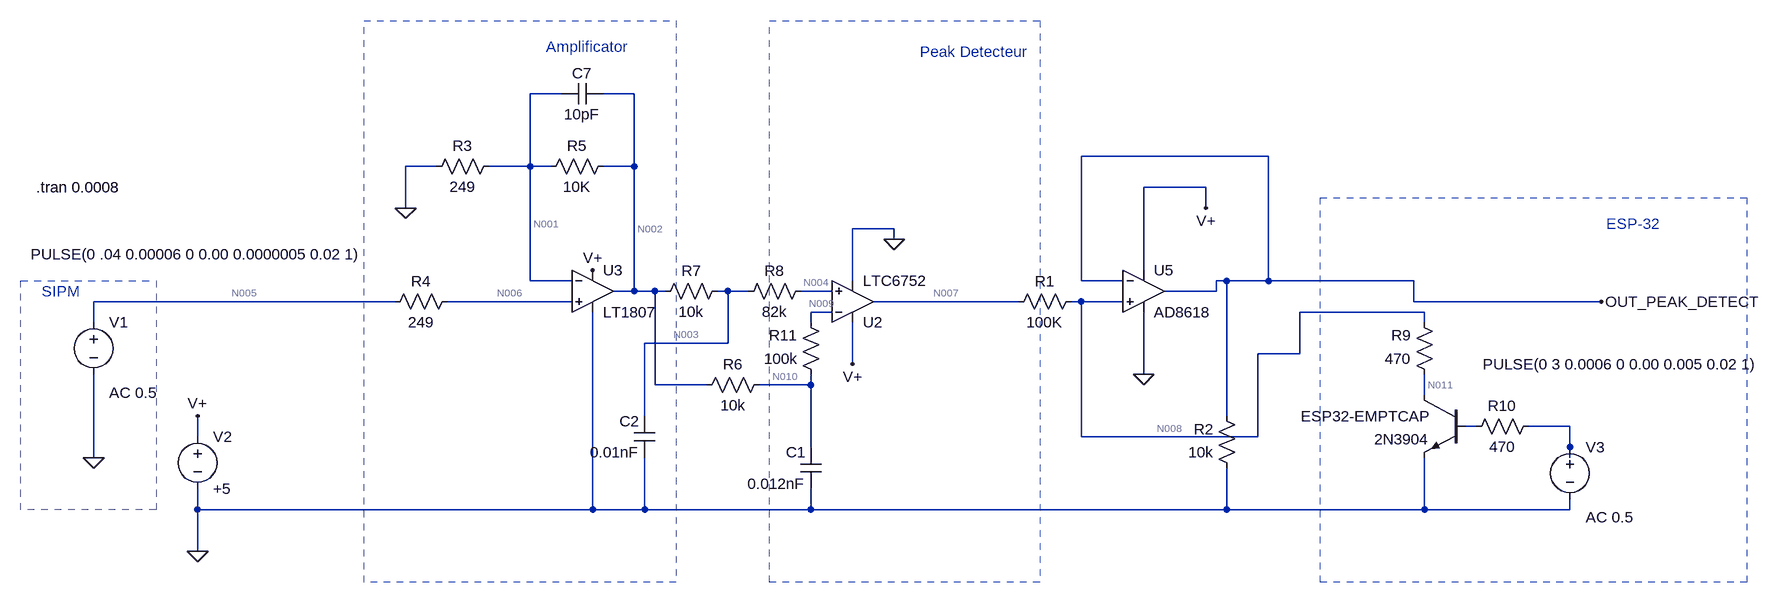
[diagram p0: schematic Muons_V4_c.asc]
Muons_V4_c.asc, the LTspice schematic file:
Version 4
SHEET 1 5945676 13421556
WIRE 624 -368 576 -368
WIRE 736 -368 688 -368
WIRE 1712 -272 1424 -272
WIRE 432 -256 384 -256
WIRE 576 -256 576 -368
WIRE 576 -256 512 -256
WIRE 608 -256 576 -256
WIRE 736 -256 736 -368
WIRE 736 -256 688 -256
WIRE 1616 -224 1520 -224
WIRE 384 -192 384 -256
WIRE 1616 -192 1616 -224
WIRE 1136 -160 1072 -160
WIRE 1136 -144 1136 -160
WIRE 1520 -96 1520 -224
WIRE 576 -80 576 -256
WIRE 640 -80 576 -80
WIRE 1072 -80 1072 -160
WIRE 1424 -80 1424 -272
WIRE 1488 -80 1424 -80
WIRE 1648 -80 1632 -80
WIRE 1712 -80 1712 -272
WIRE 1712 -80 1648 -80
WIRE 1936 -80 1712 -80
WIRE 736 -64 736 -256
WIRE 736 -64 704 -64
WIRE 768 -64 736 -64
WIRE 784 -64 768 -64
WIRE 880 -64 864 -64
WIRE 912 -64 880 -64
WIRE 1040 -64 992 -64
WIRE 1632 -64 1632 -80
WIRE 1632 -64 1552 -64
WIRE 368 -48 -96 -48
WIRE 640 -48 448 -48
WIRE 1328 -48 1104 -48
WIRE 1424 -48 1408 -48
WIRE 1488 -48 1424 -48
WIRE 1936 -48 1936 -80
WIRE 2224 -48 1936 -48
WIRE 1040 -32 1008 -32
WIRE 1952 -32 1760 -32
WIRE -96 -16 -96 -48
WIRE 1008 -16 1008 -32
WIRE 1952 -16 1952 -32
WIRE 880 16 880 -64
WIRE 880 16 752 16
WIRE 1760 32 1760 -32
WIRE 1760 32 1696 32
WIRE 1072 48 1072 -16
WIRE 1520 64 1520 -32
WIRE 768 80 768 -64
WIRE 848 80 768 80
WIRE 1008 80 1008 64
WIRE 1008 80 928 80
WIRE 1952 96 1952 64
WIRE 752 128 752 16
WIRE 1648 128 1648 -80
WIRE 2032 144 2016 144
WIRE 2176 144 2112 144
WIRE 64 160 64 128
WIRE 1424 160 1424 -48
WIRE 1696 160 1696 32
WIRE 1696 160 1424 160
WIRE 1008 176 1008 80
WIRE 2176 176 2176 144
WIRE -96 192 -96 64
WIRE 2176 192 2176 176
WIRE 64 272 64 240
WIRE 672 272 672 -32
WIRE 672 272 64 272
WIRE 752 272 752 192
WIRE 752 272 672 272
WIRE 1008 272 1008 240
WIRE 1008 272 752 272
WIRE 1648 272 1648 208
WIRE 1648 272 1008 272
WIRE 1952 272 1952 192
WIRE 1952 272 1648 272
WIRE 2176 272 2176 256
WIRE 2176 272 1952 272
WIRE 64 336 64 272
FLAG -96 192 0
FLAG 64 336 0
FLAG 672 -96 V+
FLAG 64 128 V+
FLAG 384 -192 0
FLAG 2224 -48 OUT_PEAK_DETECT
FLAG 1520 64 0
FLAG 1616 -192 V+
FLAG 1072 48 V+
FLAG 1136 -144 0
SYMBOL voltage -96 -32 R0
WINDOW 123 24 124 Left 2
WINDOW 39 0 0 Left 0
WINDOW 3 -97 -89 Left 2
SYMATTR Value2 AC 0.5
SYMATTR Value PULSE(0 .04 0.00006 0 0.00 0.0000005 0.02 1)
SYMATTR InstName V1
SYMBOL res 704 -272 R90
WINDOW 0 0 56 VBottom 2
WINDOW 3 32 56 VTop 2
SYMATTR InstName R5
SYMATTR Value 10K
SYMBOL res 464 -64 R90
WINDOW 0 0 56 VBottom 2
WINDOW 3 32 56 VTop 2
SYMATTR InstName R4
SYMATTR Value 249
SYMBOL res 528 -272 R90
WINDOW 0 0 56 VBottom 2
WINDOW 3 32 56 VTop 2
SYMATTR InstName R3
SYMATTR Value 249
SYMBOL cap 688 -384 R90
WINDOW 0 0 32 VBottom 2
WINDOW 3 32 32 VTop 2
SYMATTR InstName C7
SYMATTR Value 10pF
SYMBOL voltage 64 144 R0
WINDOW 123 0 0 Left 0
WINDOW 39 0 0 Left 0
SYMATTR InstName V2
SYMATTR Value +5
SYMBOL OpAmps\\LT1807 672 -128 R0
SYMATTR InstName U3
SYMBOL voltage 2176 160 R0
WINDOW 123 24 124 Left 2
WINDOW 39 0 0 Left 0
WINDOW 3 -134 -112 Left 2
SYMATTR Value2 AC 0.5
SYMATTR Value PULSE(0 3 0.0006 0 0.00 0.005 0.02 1)
SYMATTR InstName V3
SYMBOL res 2128 128 R90
WINDOW 0 0 56 VBottom 2
WINDOW 3 32 56 VTop 2
SYMATTR InstName R10
SYMATTR Value 470
SYMBOL npn 2016 96 M0
SYMATTR InstName ESP32-EMPTCAP
SYMATTR Value 2N3904
SYMBOL res 832 96 R270
WINDOW 0 32 56 VTop 2
WINDOW 3 0 56 VBottom 2
SYMATTR InstName R6
SYMATTR Value 10k
SYMBOL res 1968 80 R180
WINDOW 0 36 76 Left 2
WINDOW 3 36 40 Left 2
SYMATTR InstName R9
SYMATTR Value 470
SYMBOL OpAmps\\AD8618 1520 -128 R0
SYMATTR InstName U5
SYMBOL res 1424 -64 R90
WINDOW 0 0 56 VBottom 2
WINDOW 3 32 56 VTop 2
SYMATTR InstName R1
SYMATTR Value 100K
SYMBOL res 1664 224 R180
WINDOW 0 36 76 Left 2
WINDOW 3 36 40 Left 2
SYMATTR InstName R2
SYMATTR Value 10k
SYMBOL res 880 -80 R90
WINDOW 0 0 56 VBottom 2
WINDOW 3 32 56 VTop 2
SYMATTR InstName R7
SYMATTR Value 10k
SYMBOL cap 1024 240 R180
WINDOW 0 24 56 Left 2
WINDOW 3 24 8 Left 2
SYMATTR InstName C1
SYMATTR Value 0.012nF
SYMBOL res 1008 -80 R90
WINDOW 0 0 56 VBottom 2
WINDOW 3 32 56 VTop 2
SYMATTR InstName R8
SYMATTR Value 82k
SYMBOL res 1024 80 R180
WINDOW 0 36 76 Left 2
WINDOW 3 36 40 Left 2
SYMATTR InstName R11
SYMATTR Value 100k
SYMBOL Comparators\\LTC6752 1072 16 M180
SYMATTR InstName U2
SYMBOL cap 768 192 R180
WINDOW 0 24 56 Left 2
WINDOW 3 24 8 Left 2
SYMATTR InstName C2
SYMATTR Value 0.01nF
TEXT -184 -224 Left 2 !.tran 0.0008
TEXT 1176 -432 Left 2 ;Peak Detecteur
TEXT 600 -440 Left 2 ;Amplificator
TEXT 2232 -168 Left 2 ;ESP-32
TEXT -176 -64 Left 2 ;SIPM
RECTANGLE Normal 2448 384 1792 -208 2
RECTANGLE Normal 0 272 -208 -80 2
RECTANGLE Normal 1360 384 944 -480 2
RECTANGLE Normal 800 384 320 -480 2

The netlist it stands for:
* Muons_V4_c.asc
V1 N005 0 PULSE(0 .04 0.00006 0 0.00 0.0000005 0.02 1) AC 0.5
R5 N002 N001 10K
R4 N006 N005 249
R3 N001 0 249
C7 N002 N001 10pF
V2 V+ 0 +5
XU3 N006 N001 V+ 0 N002 LT1807  ; pins In+ In- V+ V- OUT
V3 N013 0 PULSE(0 3 0.0006 0 0.00 0.005 0.02 1) AC 0.5
R10 N013 N012 470
Q§ESP32-EMPTCAP N011 N012 0 0 2N3904
R6 N002 N010 10k
R9 N011 N008 470
XU5 N008 OUT_PEAK_DETECT V+ 0 OUT_PEAK_DETECT AD8618  ; pins In+ In- V+ V- OUT
R1 N008 N007 100K
R2 0 OUT_PEAK_DETECT 10k
R7 N003 N002 10k
C1 0 N010 0.012nF
R8 N004 N003 82k
R11 N010 N009 100k
XU2 N004 N009 V+ 0 N007 LTC6752  ; pins In+ In- V+ V- OUT
C2 0 N003 0.01nF
.model NPN NPN
.model PNP PNP
.lib standard.bjt
.tran 0.0008
* Peak Detecteur
* Amplificator
* ESP-32
* SIPM
.lib LTC7.lib
.backanno
.end

* Results of the author's LTspice run, read from the files saved beside the schematic
* Operating Point, zero values left out:
*   V(n002) = 2.73 mV
*   V(n001) = 1.274 mV
*   V(n006) = 1.237 mV
*   V(v+) = 5 V
*   V(n011) = 66.57 nV
*   V(n010) = 18.44 mV
*   V(n008) = 66.57 nV
*   V(out_peak_detect) = 1.484 mV
*   V(n007) = 71.57 nV
*   V(n003) = 20.78 mV
*   V(n004) = 168.8 mV
*   V(n009) = 175.6 mV
*   I(R11) = -1.571 µA
*   I(R8) = 1.805 µA
*   I(R7) = 1.805 µA
*   I(R2) = -148.4 nA
*   I(R6) = -1.571 µA
*   I(R3) = 5.115 µA
*   I(R4) = 4.969 µA
*   I(R5) = 145.6 nA
*   I(V2) = -13.12 mA
*   I(V1) = 4.969 µA
*   Ix(u3:1) = -4.969 µA
*   Ix(u3:2) = -4.969 µA
*   Ix(u3:3) = 6.315 mA
*   Ix(u3:4) = -6.308 mA
*   Ix(u3:5) = 3.231 µA
*   Ix(u5:99) = 1.36 mA
*   Ix(u5:50) = -1.36 mA
*   Ix(u5:45) = -148.4 nA
*   Ix(u2:1) = -1.805 µA
*   Ix(u2:2) = -1.571 µA
*   Ix(u2:3) = 5.445 mA
*   Ix(u2:4) = -5.442 mA
*   Ix(u2:5) = 4.95 pA
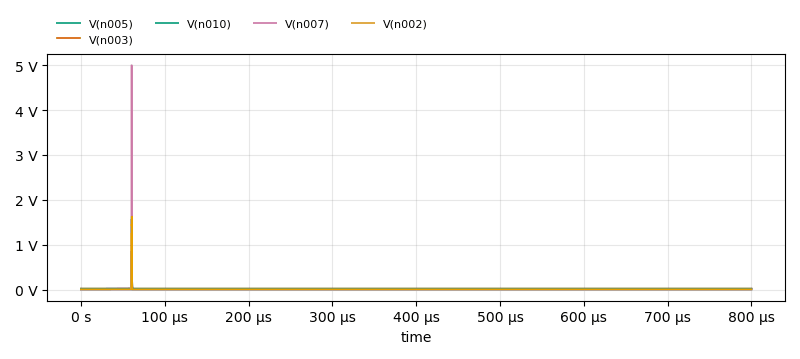
[diagram p1: Transient Analysis of Muons_V4_c.asc, plotted from the saved traces]
* Transient Analysis, 1 run:
*   V(n005): min 0 V, max 40 mV, average 27.5 µV, rms 1.033 mV, last 0 V
*   V(n003): min 20.78 mV, max 1.57 V, average 21.91 mV, rms 41.84 mV, last 20.78 mV
*   V(n010): min 18.44 mV, max 1.547 V, average 19.57 mV, rms 40.27 mV, last 18.44 mV
*   V(n007): min 0 V, max 5 V, average 3.36 mV, rms 129.6 mV, last 929.4 nV
*   V(n002): min 2.721 mV, max 1.63 V, average 3.861 mV, rms 38.42 mV, last 2.73 mV